# EAGLE design V4-AddOnESP8266-V02-004 (EAGLE 9.3.0)
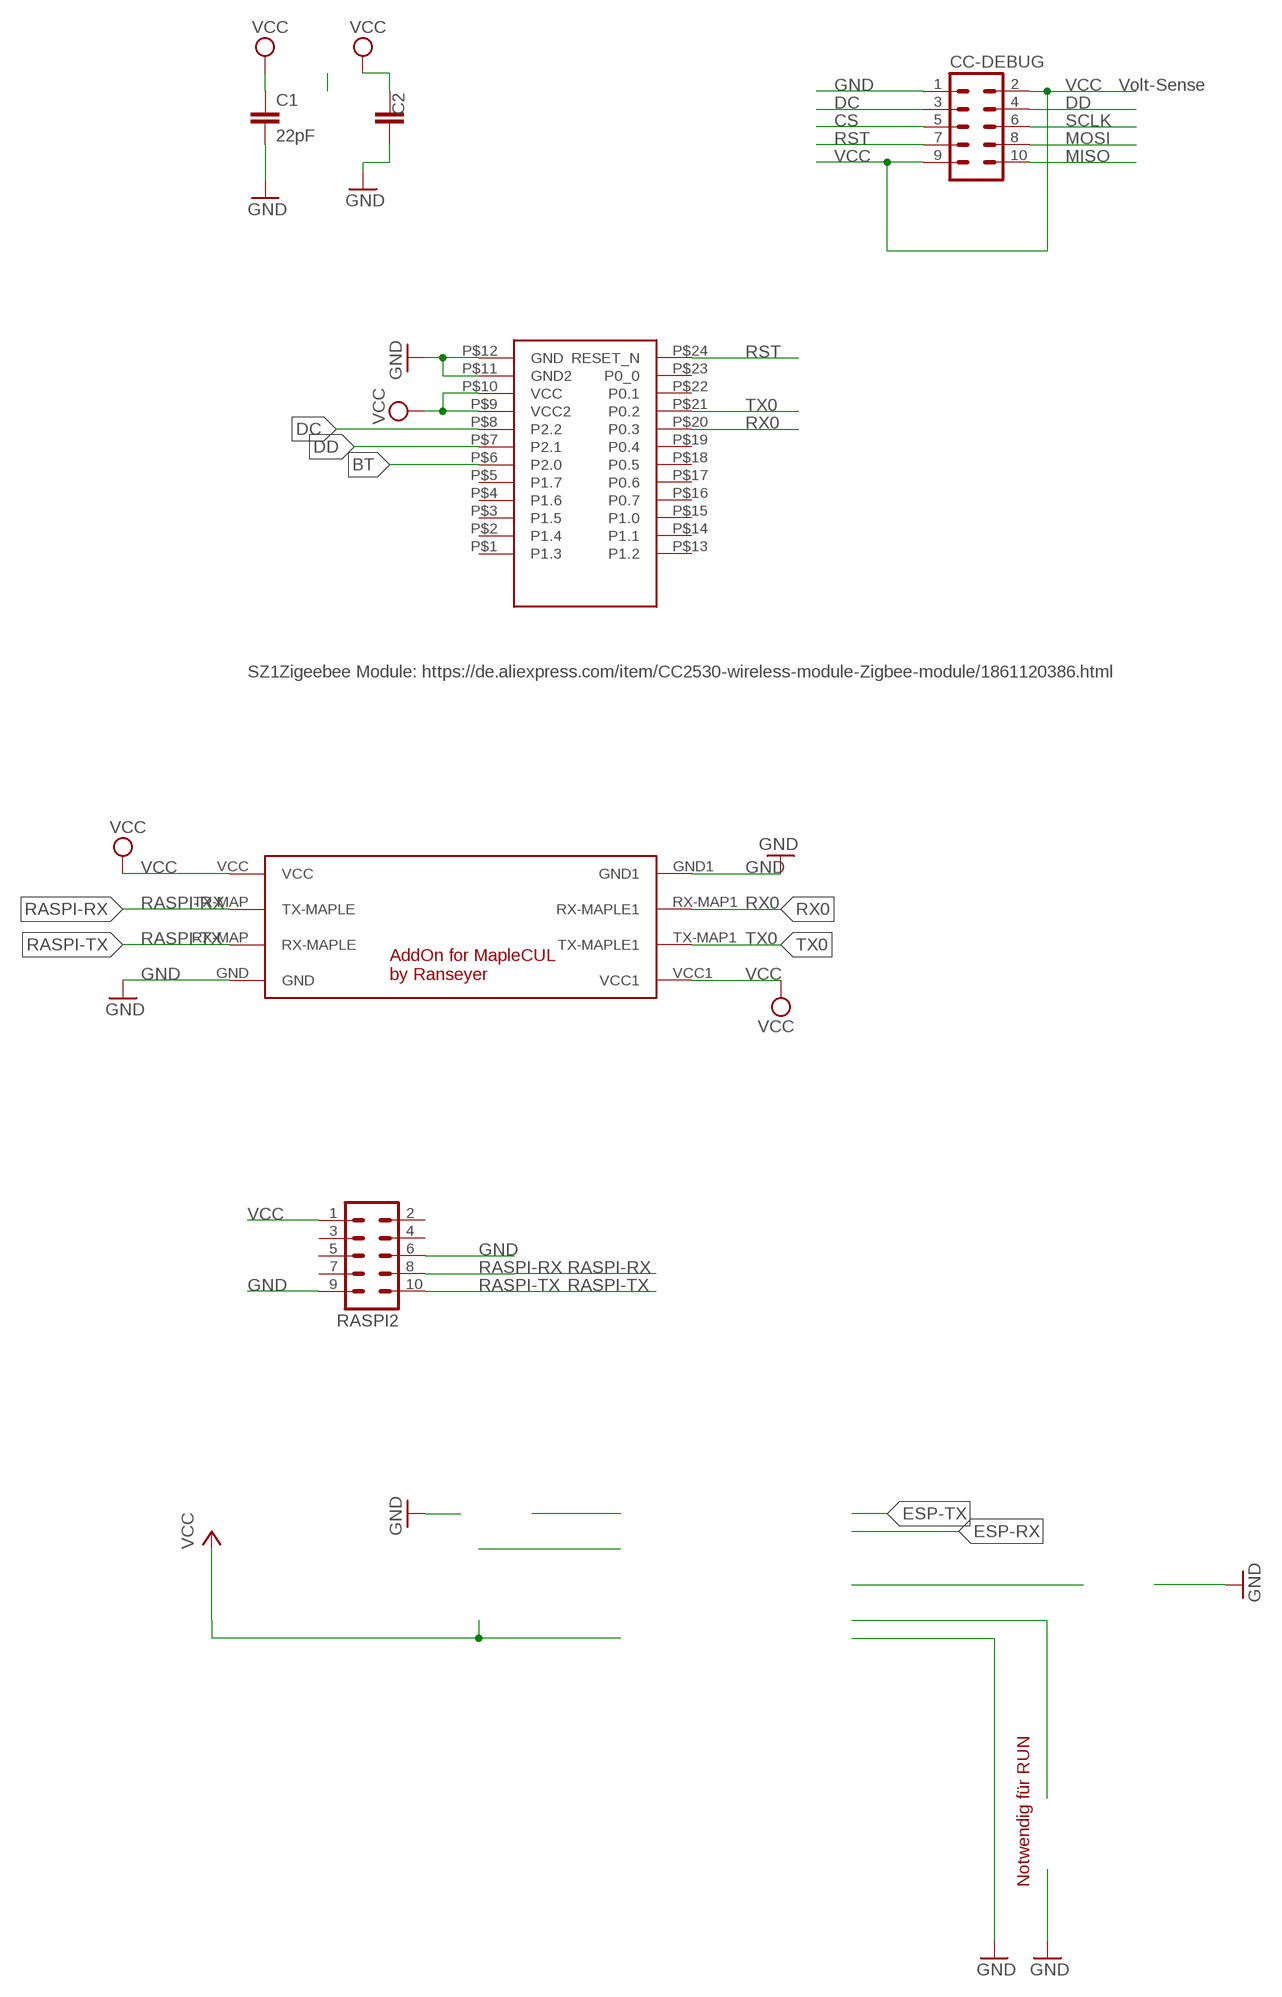
[diagram p0: schematic, sheet 1]

## Parts
C1  22pF  C-EUC0805  [C0805]
C2  C-EUC1812  [C1812]
CC-DEBUG  CONN_05X2SHD_LOCK  [2X5-SHROUDED_LOCK]
RASPI2  MA05-2  [MA05-2]
U$1  MAPLE-CUL-ADDON-V01  [MAPLE-CUL-V01]
U$2  CC2530  [SZ1ZIGBEE-SMD]

## Nets
BT: U$2.P$6(P2.0)
CS: CC-DEBUG.5
DC: CC-DEBUG.3 U$2.P$8(P2.2)
DD: CC-DEBUG.4 U$2.P$7(P2.1)
GND [PWR]: C1.2 C2.1 CC-DEBUG.1 RASPI2.6 RASPI2.9 U$1.GND U$1.GND1 U$2.P$11(GND2) U$2.P$12(GND)
MISO: CC-DEBUG.10
MOSI: CC-DEBUG.8
RASPI-RX: RASPI2.8 U$1.TX-MAP(TX-MAPLE)
RASPI-TX: RASPI2.10 U$1.RX-MAP(RX-MAPLE)
RST: CC-DEBUG.7 U$2.P$24(RESET_N)
RX0: U$1.RX-MAP1(RX-MAPLE1) U$2.P$20(P0.3)
SCLK: CC-DEBUG.6
TX0: U$1.TX-MAP1(TX-MAPLE1) U$2.P$21(P0.2)
VCC [PWR]: C1.1 C2.2 CC-DEBUG.2 CC-DEBUG.9 RASPI2.1 U$1.VCC U$1.VCC1 U$2.P$9(VCC2) U$2.P$10(VCC)
Unconnected: RASPI2.2 RASPI2.3 RASPI2.4 RASPI2.5 RASPI2.7 U$2.P$1(P1.3) U$2.P$2(P1.4) U$2.P$3(P1.5) U$2.P$4(P1.6) U$2.P$5(P1.7) U$2.P$13(P1.2) U$2.P$14(P1.1) U$2.P$15(P1.0) U$2.P$16(P0.7) U$2.P$17(P0.6) U$2.P$18(P0.5) U$2.P$19(P0.4) U$2.P$22(P0.1) U$2.P$23(P0_0)

## Notes on the sheet
- Volt-Sense
- SZ1Zigeebee Module: https://de.aliexpress.com/item/CC2530-wireless-module-Zigbee-module/1861120386.html
- Notwendig für RUN

## Library data of the parts
C1 C2 = rcl:C-EU: CAPACITOR, European symbol; SPICEPREFIX: C
CC-DEBUG = SparkFun-Connectors:CONN_05X2: Multi connection point. Often used as Generic Header-pin footprint for 0.1 inch spaced/style header connections For AVR SPI programming port, see special device with nice symbol: "AVR_SPI_PROG_5x2.dev" You can populate with any combo of single row headers, but if you'd like an exact match, check these: 2x5 AVR ICSP Male Header <https://www.sparkfun.com/products/778> (PRT-00778) 2x5 Pin Shrouded Header <https://www.sparkfun.com/products/8506> (PRT-08506) On any of the 0.1 inch spaced packages, you can populate with these: Break Away Headers - Straight <https://www.sparkfun.com/products/116> (PRT-00116) Break Away Male Headers - Right Angle <https://www.sparkfun.com/products/553> (PRT-00553) Female Headers <https://www.sparkfun.com/products/115> (PRT-00115) Break Away Headers - Machine Pin <https://www.sparkfun.com/products/117> (PRT-00117) Break Away Female Headers - Swiss Machine Pin <https://www.sparkfun.com/products/743> (PRT-00743) Special note: the shrouded connector mates well with our 5x2 ribbon cables: 2x5 Pin IDC Ribbon Cable <https://www.sparkfun.com/products/8535> (PRT-08535); PROD_ID: CONN-08671; SF_ID: PRT-08506
RASPI2 = con-lstb:MA05-2: PIN HEADER; OC_FARNELL: unknown; OC_NEWARK: unknown
U$1 = Martin-Communication-V4:MAPLE-CUL-ADDON-V01: AddOn for MAPLE-CUL V4.x
U$2 = zigbee:CC2530: CC2530 Wireless Zigbee Module 3.0-3.6V 2.405-2.485GHz SMD Pads !

## Net classes
0 default: width 0.305 mm
1 PWR: width 0.406 mm

## Board
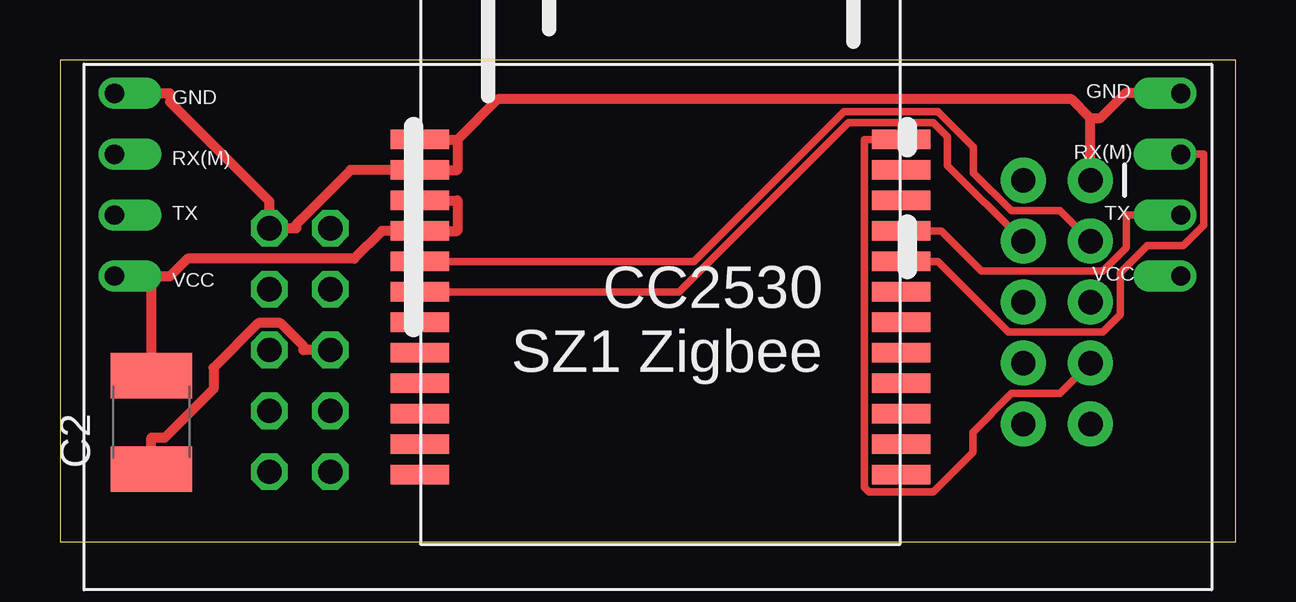
[diagram p1: board, top side]
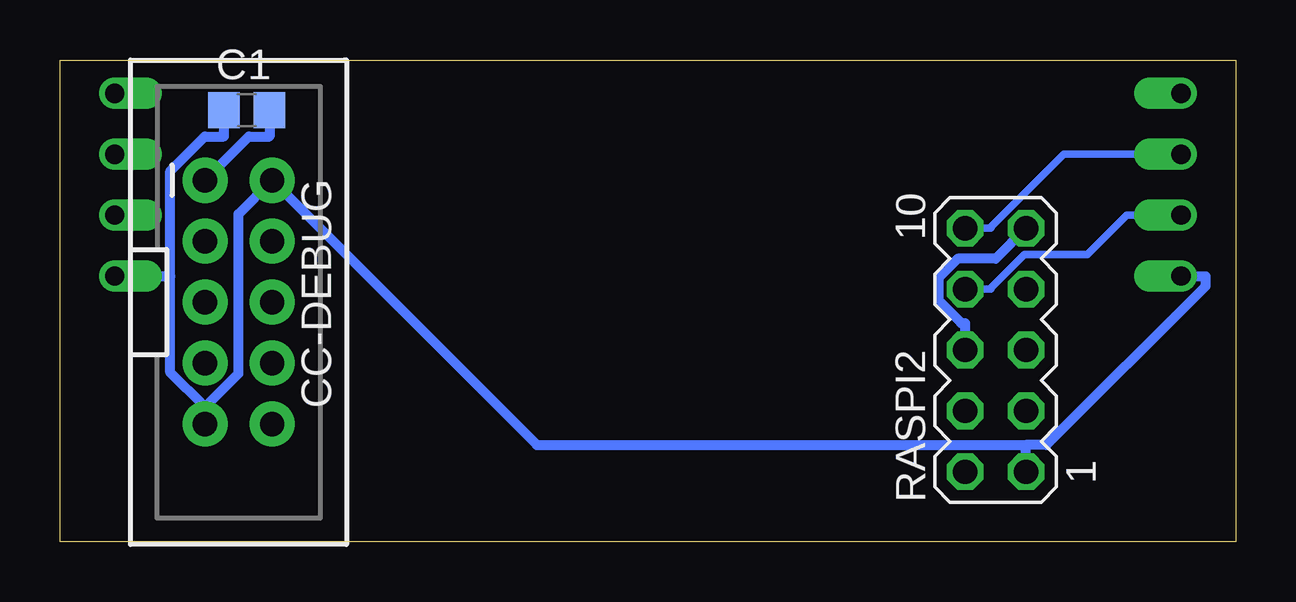
[diagram p2: board, bottom side, seen from below]

Size 49 x 20.09 mm. Coordinates in mm from the lower left corner, seen from the top.
Outline: 0,0 49,0 49,20.09 0,20.09 0,0
Copper layers (1*16): Top 0.035mm / dielectric 1.5mm / Bottom 0.035mm
Design rules "default": minimum track width 6mil, minimum drill 0.35mm, track to track 6mil, track to pad 6mil, pad to pad 6mil, via to via 6mil, smd to smd 6mil, copper to edge 40mil, drill to drill 6mil, minimum pad ring 10mil, minimum via ring 8mil, stop-mask expansion 4mil, vias tented up to drill 0mil, thermal gap 10mil

### Footprints (pad centres in the part's own frame; a part is rotated, then mirrored left to right if it is on the bottom)
C0805 = smd 1.3 x 1.5: 1 -0.95,0; 2 0.95,0
C1812 = smd 1.9 x 3.4: 1 -1.95,0; 2 1.95,0
2X5-SHROUDED_LOCK = drill 1.016 pad 1.88: 1 -1.397,5.08; 2 1.397,5.08; 3 -1.397,2.54; 4 1.397,2.54; 5 -1.397,0; 6 1.397,0; 7 -1.397,-2.54; 8 1.397,-2.54; 9 -1.397,-5.08; 10 1.397,-5.08
MA05-2 = drill 1.016 octagon: 1 -5.08,-1.27; 2 -5.08,1.27; 3 -2.54,-1.27; 4 -2.54,1.27; 5 0,-1.27; 6 0,1.27; 7 2.54,-1.27; 8 2.54,1.27; 9 5.08,-1.27; 10 5.08,1.27
MAPLE-CUL-V01 = drill 0.8 offset: GND 1.27,12.7; GND1 45.72,12.7; RX-MAP 1.27,10.16; RX-MAP1 45.72,10.16; TX-MAP 1.27,7.62; TX-MAP1 45.72,7.62; VCC 1.27,5.08; VCC1 45.72,5.08
SZ1ZIGBEE-SMD = smd 2.438 x 0.813: P$1 -10.036,-12.101; P$2 -10.036,-10.831; P$3 -10.036,-9.561; P$4 -10.036,-8.291; P$5 -10.036,-7.021; P$6 -10.036,-5.751; P$7 -10.036,-4.481; P$8 -10.036,-3.211; P$9 -10.036,-1.941; P$10 -10.036,-0.671; P$11 -10.036,0.599; P$12 -10.036,1.869; P$13 10.03,-12.101; P$14 10.03,-10.831; P$15 10.03,-9.561; P$16 10.03,-8.291; P$17 10.03,-7.021; P$18 10.03,-5.751; P$19 10.03,-4.481; P$20 10.03,-3.211; P$21 10.03,-1.941; P$22 10.03,-0.671; P$23 10.03,0.599; P$24 10.03,1.869

### Placement (x,y rotation side)
C1  41.22,18 0 bottom
C2  3.81,4.99 90 top
CC-DEBUG  41.55,9.99 0 bottom
RASPI2  10,8 90 bottom
U$1  1,6 0 top
U$2  25.03,14.91 0 top

### Tracks (layer width: path | path; a pad name or v marks a point on that pad's centre or on a via)
DC
  Top 0.305: CC-DEBUG.3 41.68,13.8 39.66,13.8 38.08,15.39 38.08,16.46 36.6,17.94 32.68,17.94 26.43,11.69 U$2.P$8
DD
  Top 0.305: U$2.P$7 25.81,10.42 32.87,17.49 36.41,17.49 37,16.89 37,15.69 CC-DEBUG.4
GND
  Top 0.406: 42.95,17.67 42.17,18.45 18.25,18.45 16.57,16.77 | C2.1 3.81,4.34 4.37,4.34 6.4,6.37 6.4,7.26 8.27,9.12 9.2,9.12 10.15,8.17 10.15,8 RASPI2.6 | 16.57,16.77 16.57,15.5 U$2.P$11 12.11,15.5 9.85,13.24 9.85,13.08 RASPI2.9 8.73,14.2 4.59,18.34 4.59,18.7 U$1.GND | 42.95,17.67 43.37,17.67 44.4,18.7 U$1.GND1 | CC-DEBUG.1 42.95,17.67 | U$2.P$12 16.57,16.77
  Bottom 0.406: C1.2 40.27,16.9 41.13,16.9 CC-DEBUG.1 | RASPI2.6 11.27,9.12 11.43,9.12 12.39,10.08 12.39,11 11.58,11.81 10,11.81 RASPI2.9
RASPI-RX
  Bottom 0.305: RASPI2.8 10.2,10.54 10.2,10.58 8.81,11.97 6.18,11.97 4.54,13.62 U$1.TX-MAP
RASPI-TX
  Bottom 0.305: RASPI2.10 10.2,13.08 10.2,13.12 7.17,16.16 U$1.RX-MAP
RST
  Top 0.305: U$2.P$24 33.54,16.77 33.54,2.27 33.72,2.09 36.41,2.09 38.05,3.73 38.05,4.57 39.66,6.19 41.68,6.19 CC-DEBUG.7
RX0
  Top 0.305: U$1.RX-MAP1 47.68,16.16 47.68,13.22 46.81,12.35 45.33,12.35 44.2,11.22 44.2,9.48 43.47,8.75 39.53,8.75 36.58,11.69 U$2.P$20
TX0
  Top 0.305: U$1.TX-MAP1 44.45,13.62 44.45,12.28 43.47,11.29 38.41,11.29 36.74,12.96 U$2.P$21
VCC
  Top 0.406: U$2.P$10 16.57,14.23 16.57,12.96 U$2.P$9 13.42,12.96 12.27,11.81 5.32,11.81 4.59,11.08 3.43,11.08 | 3.43,11.08 3.81,10.7 C2.2 | U$1.VCC 3.43,11.08
  Bottom 0.406: 8.73,4.04 29.12,4.04 CC-DEBUG.2 41.55,13.68 41.55,7.02 42.96,5.62 | RASPI2.1 8.73,4.04 | U$1.VCC 1.26,11.08 1.26,10.66 7.88,4.04 8.73,4.04 | CC-DEBUG.9 42.96,5.62 | 42.96,5.62 44.4,7.06 44.4,11.08 | 44.4,11.08 44.4,15.46 42.97,16.9 42.17,16.9 C1.1 | U$1.VCC1 44.4,11.08